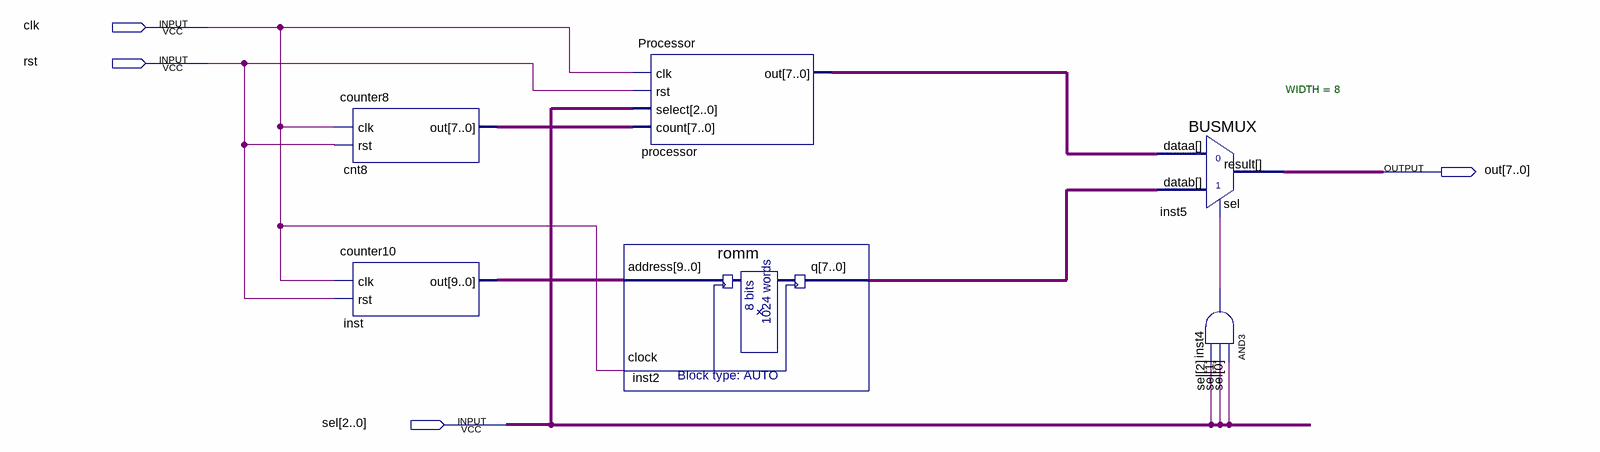
[diagram p0: schematic sheet]
// Quartus schematic WaveformGenerator.bdf as structural Verilog: 6 symbols, 4 pins
module WaveformGenerator (
  input  clk,
  input  rst,
  input  [2:0] sel,
  output [7:0] out
);

  wire inst4_out;
  wire [7:0] cnt8_out, inst2_q, processor_out;
  wire [9:0] inst_out;

  counter8 cnt8 (.clk(clk), .rst(rst), .out(cnt8_out));
  counter10 inst (.clk(clk), .rst(rst), .out(inst_out));
  Processor processor (.clk(clk), .rst(rst), .select(sel), .count(cnt8_out), .out(processor_out));
  romm inst2 (.address(inst_out), .clock(clk), .q(inst2_q));
  BUSMUX #(.WIDTH(8)) inst5 (.datab(inst2_q), .sel(inst4_out), .dataa(processor_out), .result(out));
  and inst4 (inst4_out, sel[0], sel[1], sel[2]);
endmodule
